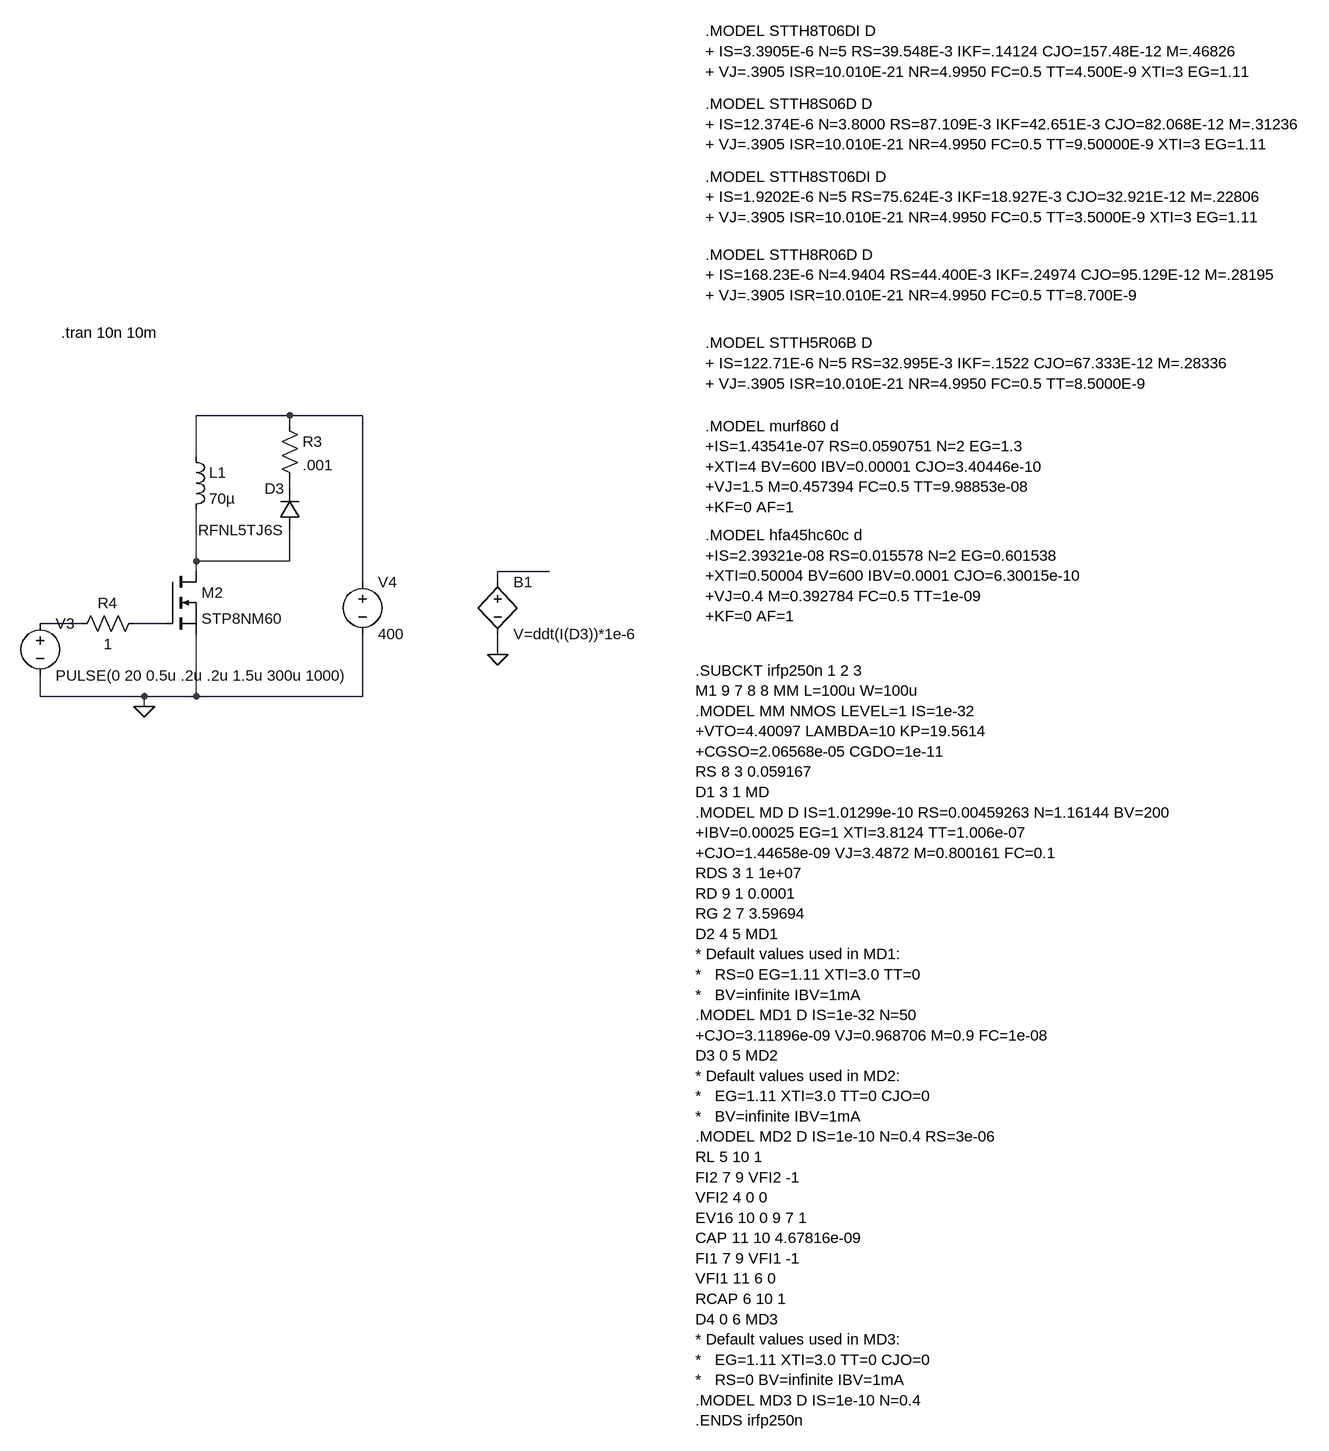
[diagram p0: schematic SWLossD_old.asc]
SWLossD_old.asc, the LTspice schematic file:
Version 4
SHEET 1 2040 1508
WIRE 208 288 64 288
WIRE 320 288 208 288
WIRE 208 304 208 288
WIRE 64 352 64 288
WIRE 208 400 208 384
WIRE 64 512 64 432
WIRE 208 512 208 464
WIRE 208 512 64 512
WIRE 64 528 64 512
WIRE 608 528 528 528
WIRE 320 544 320 288
WIRE 528 544 528 528
WIRE -112 608 -176 608
WIRE 16 608 -32 608
WIRE 528 656 528 624
WIRE -176 720 -176 688
WIRE -16 720 -176 720
WIRE 64 720 64 624
WIRE 64 720 -16 720
WIRE 320 720 320 624
WIRE 320 720 64 720
WIRE -16 736 -16 720
FLAG -16 736 0
FLAG 528 656 0
SYMBOL voltage -176 592 R0
SYMATTR InstName V3
SYMATTR Value PULSE(0 20 0.5u .2u .2u 1.5u 300u 1000)
SYMBOL diode 224 464 R180
WINDOW 0 24 64 Left 2
WINDOW 3 24 0 Left 2
SYMATTR InstName D3
SYMATTR Value RFNL5TJ6S
SYMBOL res -16 592 R90
WINDOW 0 0 56 VBottom 2
WINDOW 3 32 56 VTop 2
SYMATTR InstName R4
SYMATTR Value 1
SYMBOL ind 48 336 R0
SYMATTR InstName L1
SYMATTR Value 70µ
SYMATTR SpiceLine Rser=.1
SYMBOL voltage 320 528 R0
SYMATTR InstName V4
SYMATTR Value 400
SYMATTR SpiceLine Rser=.1
SYMBOL nmos 16 528 R0
SYMATTR InstName M2
SYMATTR Value STP8NM60
SYMBOL bv 528 528 R0
SYMATTR InstName B1
SYMATTR Value V=ddt(I(D3))*1e-6
SYMBOL res 192 288 R0
SYMATTR InstName R3
SYMATTR Value .001
TEXT -144 160 Left 2 !.tran 10n 10m
TEXT 848 304 Left 2 !.MODEL murf860 d\n+IS=1.43541e-07 RS=0.0590751 N=2 EG=1.3\n+XTI=4 BV=600 IBV=0.00001 CJO=3.40446e-10\n+VJ=1.5 M=0.457394 FC=0.5 TT=9.98853e-08\n+KF=0 AF=1
TEXT 848 472 Left 2 !.MODEL hfa45hc60c d\n+IS=2.39321e-08 RS=0.015578 N=2 EG=0.601538\n+XTI=0.50004 BV=600 IBV=0.0001 CJO=6.30015e-10\n+VJ=0.4 M=0.392784 FC=0.5 TT=1e-09\n+KF=0 AF=1
TEXT 832 680 Left 2 !.SUBCKT irfp250n 1 2 3\nM1 9 7 8 8 MM L=100u W=100u\n.MODEL MM NMOS LEVEL=1 IS=1e-32\n+VTO=4.40097 LAMBDA=10 KP=19.5614\n+CGSO=2.06568e-05 CGDO=1e-11\nRS 8 3 0.059167\nD1 3 1 MD\n.MODEL MD D IS=1.01299e-10 RS=0.00459263 N=1.16144 BV=200\n+IBV=0.00025 EG=1 XTI=3.8124 TT=1.006e-07\n+CJO=1.44658e-09 VJ=3.4872 M=0.800161 FC=0.1\nRDS 3 1 1e+07\nRD 9 1 0.0001\nRG 2 7 3.59694\nD2 4 5 MD1\n* Default values used in MD1:\n*   RS=0 EG=1.11 XTI=3.0 TT=0\n*   BV=infinite IBV=1mA\n.MODEL MD1 D IS=1e-32 N=50\n+CJO=3.11896e-09 VJ=0.968706 M=0.9 FC=1e-08\nD3 0 5 MD2\n* Default values used in MD2:\n*   EG=1.11 XTI=3.0 TT=0 CJO=0\n*   BV=infinite IBV=1mA\n.MODEL MD2 D IS=1e-10 N=0.4 RS=3e-06\nRL 5 10 1\nFI2 7 9 VFI2 -1\nVFI2 4 0 0\nEV16 10 0 9 7 1\nCAP 11 10 4.67816e-09\nFI1 7 9 VFI1 -1\nVFI1 11 6 0\nRCAP 6 10 1\nD4 0 6 MD3\n* Default values used in MD3:\n*   EG=1.11 XTI=3.0 TT=0 CJO=0\n*   RS=0 BV=infinite IBV=1mA\n.MODEL MD3 D IS=1e-10 N=0.4\n.ENDS irfp250n
TEXT 848 176 Left 2 !.MODEL STTH5R06B D\n+ IS=122.71E-6 N=5 RS=32.995E-3 IKF=.1522 CJO=67.333E-12 M=.28336\n+ VJ=.3905 ISR=10.010E-21 NR=4.9950 FC=0.5 TT=8.5000E-9
TEXT 848 40 Left 2 !.MODEL STTH8R06D D\n+ IS=168.23E-6 N=4.9404 RS=44.400E-3 IKF=.24974 CJO=95.129E-12 M=.28195\n+ VJ=.3905 ISR=10.010E-21 NR=4.9950 FC=0.5 TT=8.700E-9
TEXT 848 -80 Left 2 !.MODEL STTH8ST06DI D\n+ IS=1.9202E-6 N=5 RS=75.624E-3 IKF=18.927E-3 CJO=32.921E-12 M=.22806\n+ VJ=.3905 ISR=10.010E-21 NR=4.9950 FC=0.5 TT=3.5000E-9 XTI=3 EG=1.11
TEXT 848 -192 Left 2 !.MODEL STTH8S06D D\n+ IS=12.374E-6 N=3.8000 RS=87.109E-3 IKF=42.651E-3 CJO=82.068E-12 M=.31236\n+ VJ=.3905 ISR=10.010E-21 NR=4.9950 FC=0.5 TT=9.50000E-9 XTI=3 EG=1.11
TEXT 848 -304 Left 2 !.MODEL STTH8T06DI D\n+ IS=3.3905E-6 N=5 RS=39.548E-3 IKF=.14124 CJO=157.48E-12 M=.46826\n+ VJ=.3905 ISR=10.010E-21 NR=4.9950 FC=0.5 TT=4.500E-9 XTI=3 EG=1.11

The netlist it stands for:
* SWLossD_old.asc
V3 N005 0 PULSE(0 20 0.5u .2u .2u 1.5u 300u 1000)
D3 N003 N002 RFNL5TJ6S
R4 N006 N005 1
L1 N001 N003 70µ Rser=.1
V4 N001 0 400 Rser=.1
M2 N003 N006 0 0 STP8NM60
B1 N004 0 V=ddt(I(D3))*1e-6
R3 N001 N002 .001
.model D D
.lib standard.dio
.model NMOS NMOS
.model PMOS PMOS
.lib standard.mos
.tran 10n 10m
.MODEL murf860 d
+IS=1.43541e-07 RS=0.0590751 N=2 EG=1.3
+XTI=4 BV=600 IBV=0.00001 CJO=3.40446e-10
+VJ=1.5 M=0.457394 FC=0.5 TT=9.98853e-08
+KF=0 AF=1
.MODEL hfa45hc60c d
+IS=2.39321e-08 RS=0.015578 N=2 EG=0.601538
+XTI=0.50004 BV=600 IBV=0.0001 CJO=6.30015e-10
+VJ=0.4 M=0.392784 FC=0.5 TT=1e-09
+KF=0 AF=1
.SUBCKT irfp250n 1 2 3
M1 9 7 8 8 MM L=100u W=100u
.MODEL MM NMOS LEVEL=1 IS=1e-32
+VTO=4.40097 LAMBDA=10 KP=19.5614
+CGSO=2.06568e-05 CGDO=1e-11
RS 8 3 0.059167
D1 3 1 MD
.MODEL MD D IS=1.01299e-10 RS=0.00459263 N=1.16144 BV=200
+IBV=0.00025 EG=1 XTI=3.8124 TT=1.006e-07
+CJO=1.44658e-09 VJ=3.4872 M=0.800161 FC=0.1
RDS 3 1 1e+07
RD 9 1 0.0001
RG 2 7 3.59694
D2 4 5 MD1
* Default values used in MD1:
*   RS=0 EG=1.11 XTI=3.0 TT=0
*   BV=infinite IBV=1mA
.MODEL MD1 D IS=1e-32 N=50
+CJO=3.11896e-09 VJ=0.968706 M=0.9 FC=1e-08
D3 0 5 MD2
* Default values used in MD2:
*   EG=1.11 XTI=3.0 TT=0 CJO=0
*   BV=infinite IBV=1mA
.MODEL MD2 D IS=1e-10 N=0.4 RS=3e-06
RL 5 10 1
FI2 7 9 VFI2 -1
VFI2 4 0 0
EV16 10 0 9 7 1
CAP 11 10 4.67816e-09
FI1 7 9 VFI1 -1
VFI1 11 6 0
RCAP 6 10 1
D4 0 6 MD3
* Default values used in MD3:
*   EG=1.11 XTI=3.0 TT=0 CJO=0
*   RS=0 BV=infinite IBV=1mA
.MODEL MD3 D IS=1e-10 N=0.4
.ENDS irfp250n
.MODEL STTH5R06B D
+ IS=122.71E-6 N=5 RS=32.995E-3 IKF=.1522 CJO=67.333E-12 M=.28336
+ VJ=.3905 ISR=10.010E-21 NR=4.9950 FC=0.5 TT=8.5000E-9
.MODEL STTH8R06D D
+ IS=168.23E-6 N=4.9404 RS=44.400E-3 IKF=.24974 CJO=95.129E-12 M=.28195
+ VJ=.3905 ISR=10.010E-21 NR=4.9950 FC=0.5 TT=8.700E-9
.MODEL STTH8ST06DI D
+ IS=1.9202E-6 N=5 RS=75.624E-3 IKF=18.927E-3 CJO=32.921E-12 M=.22806
+ VJ=.3905 ISR=10.010E-21 NR=4.9950 FC=0.5 TT=3.5000E-9 XTI=3 EG=1.11
.MODEL STTH8S06D D
+ IS=12.374E-6 N=3.8000 RS=87.109E-3 IKF=42.651E-3 CJO=82.068E-12 M=.31236
+ VJ=.3905 ISR=10.010E-21 NR=4.9950 FC=0.5 TT=9.50000E-9 XTI=3 EG=1.11
.MODEL STTH8T06DI D
+ IS=3.3905E-6 N=5 RS=39.548E-3 IKF=.14124 CJO=157.48E-12 M=.46826
+ VJ=.3905 ISR=10.010E-21 NR=4.9950 FC=0.5 TT=4.500E-9 XTI=3 EG=1.11
.backanno
.end